# Altium project EBAZ4205扩展.PrjPcb
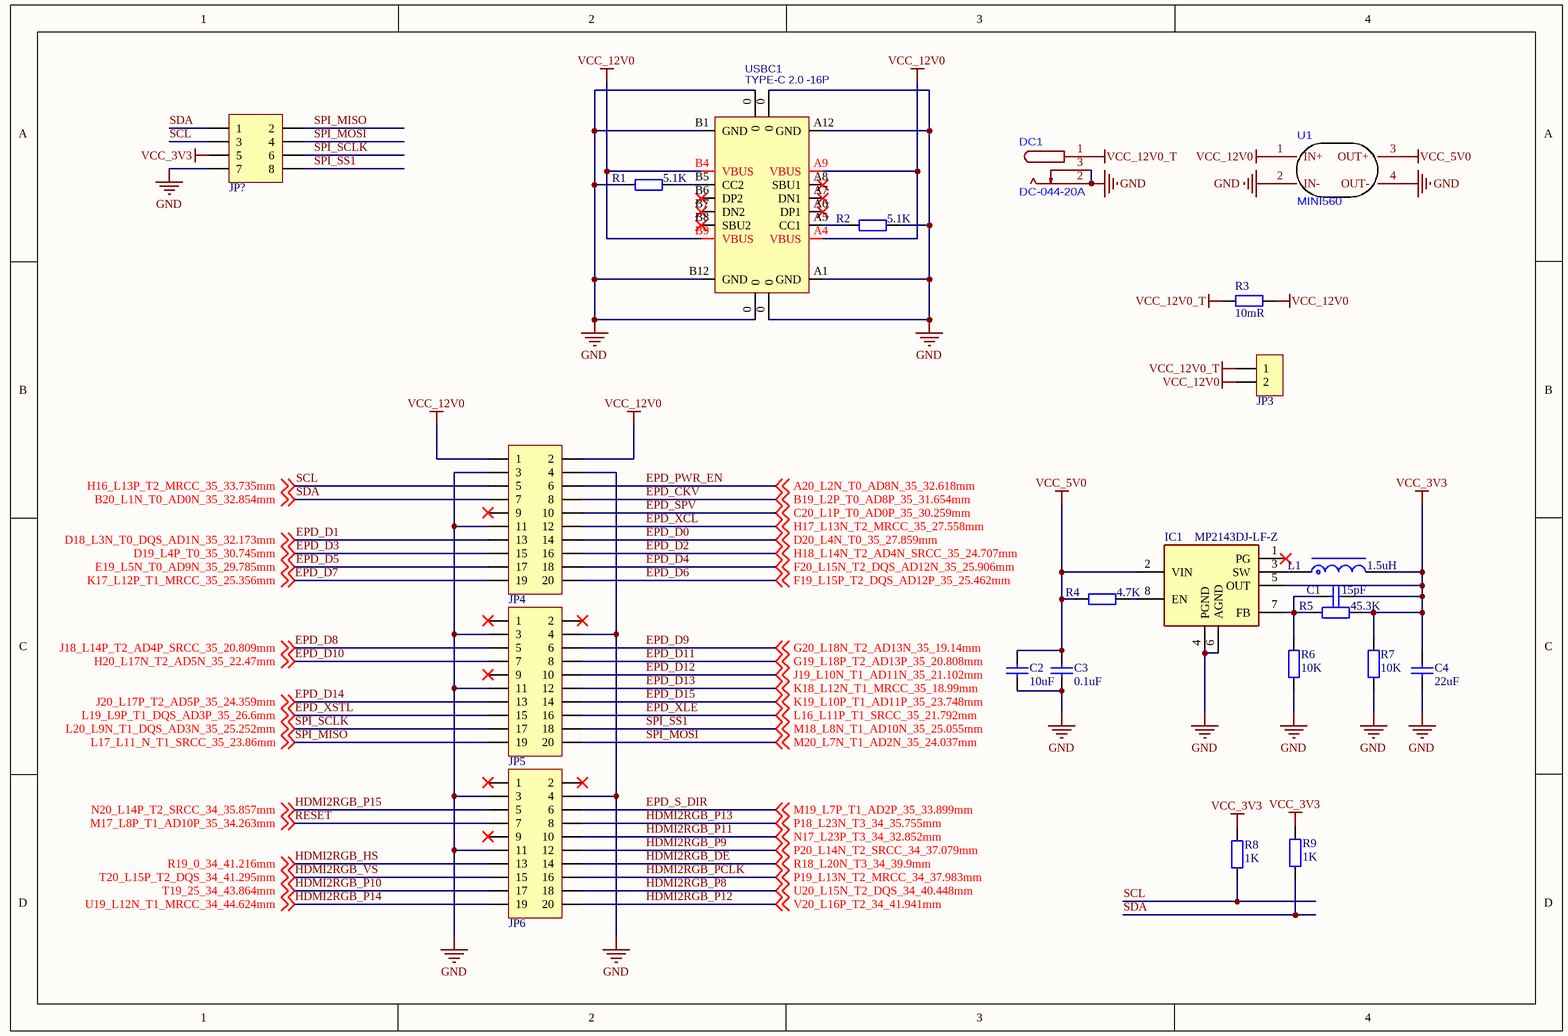
[diagram p0: EBAZ4205扩展_连接.SchDoc]
4 sheets, 110 parts. Net scope: global (net labels, ports and power ports of the same name join across sheets).
Board file: EBAZ4205扩展.PcbDoc
Sheets:
  EBAZ4205扩展_连接.SchDoc
  EBAZ4205扩展_RGB_RX.SchDoc
  EBAZ4205扩展_TPS65185.SchDoc
  EBAZ4205扩展_EPD_TX.SchDoc

## Sheet EBAZ4205扩展_连接.SchDoc
size A4; DocumentNumber: 4; SheetNumber: 1; SheetTotal: 4

### Parts
C1  15pF  [C0402_L]
C2  10uF  [C0805_L]
C3  0.1uF  [C0402_L]
C4  22uF  [C0805_L]
DC1  DC-044-20A  [DC-IN-TH_DC-044-20A]
IC1  MP2143DJ-LF-Z  [SOP65P280X100-8N]
JP3  HDR-1X2  [HDR1.27-LI-2P]  (value not drawn)
JP4  Header 2X10  [PHD2.0-LI-2x10P]  (value not drawn)
JP5  Header 2X10  [PHD2.0-LI-2x10P]  (value not drawn)
JP6  Header 2X10  [PHD2.0-LI-2x10P]  (value not drawn)
JP?  Header 4X2  [HDR2.54-LI-2x4P]  (value not drawn)
L1  1.5uH  [NR3010]
R1  5.1K  [R0402_L]
R2  5.1K  [R0402_L]
R3  10mR  [R0805-HP_L]
R4  4.7K  [R0402_L]
R5  45.3K  [R0402_L]
R6  10K  [R0402_L]
R7  10K  [R0402_L]
R8  1K  [R0402_L]
R9  1K  [R0402_L]
U1  MINI560  [MINI560]
USBC1  TYPE-C 2.0 -16P  [USB-C-SMD_16P]

### Nets
GND: C2.1 C3.1 C4.1 DC1.2 DC1.3 IC1.4(PGND) IC1.6(AGND) JP4.3 JP4.4 JP4.11 JP5.3 JP5.4 JP5.11 JP6.3 JP6.4 JP6.11 JP?.7 R1.2 R2.1 R6.1 R7.1 U1.2(IN-) U1.4(OUT-) USBC1.0 USBC1.A1(GND) USBC1.A12(GND) USBC1.B1(GND) USBC1.B12(GND)
VCC_3V3: C1.1 C4.2 IC1.5(OUT) JP?.5 L1.2 R5.1 R7.2 R8.2 R9.2
VCC_5V0: C2.2 C3.2 IC1.2(VIN) R4.2 U1.3(OUT+)
VCC_12V0: JP3.2 JP4.1 JP4.2 R3.2 U1.1(IN+) USBC1.A4(VBUS) USBC1.A9(VBUS) USBC1.B4(VBUS) USBC1.B9(VBUS)
VCC_12V0_T: DC1.1 JP3.1 R3.1
EPD_CKV: JP4.8 ; off-sheet B19_L2P_T0_AD8P_35_31.654mm  [also labelled B19_L2P_T0_AD8P_35_31.654mm]
EPD_D0: JP4.14 ; off-sheet D20_L4N_T0_35_27.859mm  [also labelled D20_L4N_T0_35_27.859mm]
EPD_D1: JP4.13 ; off-sheet D18_L3N_T0_DQS_AD1N_35_32.173mm  [also labelled D18_L3N_T0_DQS_AD1N_35_32.173mm]
EPD_D2: JP4.16 ; off-sheet H18_L14N_T2_AD4N_SRCC_35_24.707mm  [also labelled H18_L14N_T2_AD4N_SRCC_35_24.707mm]
EPD_D3: JP4.15 ; off-sheet D19_L4P_T0_35_30.745mm  [also labelled D19_L4P_T0_35_30.745mm]
EPD_D4: JP4.18 ; off-sheet F20_L15N_T2_DQS_AD12N_35_25.906mm  [also labelled F20_L15N_T2_DQS_AD12N_35_25.906mm]
EPD_D5: JP4.17 ; off-sheet E19_L5N_T0_AD9N_35_29.785mm  [also labelled E19_L5N_T0_AD9N_35_29.785mm]
EPD_D6: JP4.20 ; off-sheet F19_L15P_T2_DQS_AD12P_35_25.462mm  [also labelled F19_L15P_T2_DQS_AD12P_35_25.462mm]
EPD_D7: JP4.19 ; off-sheet K17_L12P_T1_MRCC_35_25.356mm  [also labelled K17_L12P_T1_MRCC_35_25.356mm]
EPD_D8: JP5.5 ; off-sheet J18_L14P_T2_AD4P_SRCC_35_20.809mm  [also labelled J18_L14P_T2_AD4P_SRCC_35_20.809mm]
EPD_D9: JP5.6 ; off-sheet G20_L18N_T2_AD13N_35_19.14mm  [also labelled G20_L18N_T2_AD13N_35_19.14mm]
EPD_D10: JP5.7 ; off-sheet H20_L17N_T2_AD5N_35_22.47mm  [also labelled H20_L17N_T2_AD5N_35_22.47mm]
EPD_D11: JP5.8 ; off-sheet G19_L18P_T2_AD13P_35_20.808mm  [also labelled G19_L18P_T2_AD13P_35_20.808mm]
EPD_D12: JP5.10 ; off-sheet J19_L10N_T1_AD11N_35_21.102mm  [also labelled J19_L10N_T1_AD11N_35_21.102mm]
EPD_D13: JP5.12 ; off-sheet K18_L12N_T1_MRCC_35_18.99mm  [also labelled K18_L12N_T1_MRCC_35_18.99mm]
EPD_D14: JP5.13 ; off-sheet J20_L17P_T2_AD5P_35_24.359mm  [also labelled J20_L17P_T2_AD5P_35_24.359mm]
EPD_D15: JP5.14 ; off-sheet K19_L10P_T1_AD11P_35_23.748mm  [also labelled K19_L10P_T1_AD11P_35_23.748mm]
EPD_PWR_EN: JP4.6 ; off-sheet A20_L2N_T0_AD8N_35_32.618mm  [also labelled A20_L2N_T0_AD8N_35_32.618mm]
EPD_S_DIR: JP6.6 ; off-sheet M19_L7P_T1_AD2P_35_33.899mm  [also labelled M19_L7P_T1_AD2P_35_33.899mm]
EPD_SPV: JP4.10 ; off-sheet C20_L1P_T0_AD0P_35_30.259mm  [also labelled C20_L1P_T0_AD0P_35_30.259mm]
EPD_XCL: JP4.12 ; off-sheet H17_L13N_T2_MRCC_35_27.558mm  [also labelled H17_L13N_T2_MRCC_35_27.558mm]
EPD_XLE: JP5.16 ; off-sheet L16_L11P_T1_SRCC_35_21.792mm  [also labelled L16_L11P_T1_SRCC_35_21.792mm]
EPD_XSTL: JP5.15 ; off-sheet L19_L9P_T1_DQS_AD3P_35_26.6mm  [also labelled L19_L9P_T1_DQS_AD3P_35_26.6mm]
HDMI2RGB_DE: JP6.14 ; off-sheet R18_L20N_T3_34_39.9mm  [also labelled R18_L20N_T3_34_39.9mm]
HDMI2RGB_HS: JP6.13 ; off-sheet R19_0_34_41.216mm  [also labelled R19_0_34_41.216mm]
HDMI2RGB_P8: JP6.18 ; off-sheet U20_L15N_T2_DQS_34_40.448mm  [also labelled U20_L15N_T2_DQS_34_40.448mm]
HDMI2RGB_P9: JP6.12 ; off-sheet P20_L14N_T2_SRCC_34_37.079mm  [also labelled P20_L14N_T2_SRCC_34_37.079mm]
HDMI2RGB_P10: JP6.17 ; off-sheet T19_25_34_43.864mm  [also labelled T19_25_34_43.864mm]
HDMI2RGB_P11: JP6.10 ; off-sheet N17_L23P_T3_34_32.852mm  [also labelled N17_L23P_T3_34_32.852mm]
HDMI2RGB_P12: JP6.20 ; off-sheet V20_L16P_T2_34_41.941mm  [also labelled V20_L16P_T2_34_41.941mm]
HDMI2RGB_P13: JP6.8 ; off-sheet P18_L23N_T3_34_35.755mm  [also labelled P18_L23N_T3_34_35.755mm]
HDMI2RGB_P14: JP6.19 ; off-sheet U19_L12N_T1_MRCC_34_44.624mm  [also labelled U19_L12N_T1_MRCC_34_44.624mm]
HDMI2RGB_P15: JP6.5 ; off-sheet N20_L14P_T2_SRCC_34_35.857mm  [also labelled N20_L14P_T2_SRCC_34_35.857mm]
HDMI2RGB_PCLK: JP6.16 ; off-sheet P19_L13N_T2_MRCC_34_37.983mm  [also labelled P19_L13N_T2_MRCC_34_37.983mm]
HDMI2RGB_VS: JP6.15 ; off-sheet T20_L15P_T2_DQS_34_41.295mm  [also labelled T20_L15P_T2_DQS_34_41.295mm]
RESET: JP6.7 ; off-sheet M17_L8P_T1_AD10P_35_34.263mm  [also labelled M17_L8P_T1_AD10P_35_34.263mm]
SCL: JP4.5 JP?.3 R8.1 ; off-sheet H16_L13P_T2_MRCC_35_33.735mm  [also labelled H16_L13P_T2_MRCC_35_33.735mm]
SDA: JP4.7 JP?.1 R9.1 ; off-sheet B20_L1N_T0_AD0N_35_32.854mm  [also labelled B20_L1N_T0_AD0N_35_32.854mm]
SPI_MISO: JP5.19 JP?.2 ; off-sheet L17_L11_N_T1_SRCC_35_23.86mm  [also labelled L17_L11_N_T1_SRCC_35_23.86mm]
SPI_MOSI: JP5.20 JP?.4 ; off-sheet M20_L7N_T1_AD2N_35_24.037mm  [also labelled M20_L7N_T1_AD2N_35_24.037mm]
SPI_SCLK: JP5.17 JP?.6 ; off-sheet L20_L9N_T1_DQS_AD3N_35_25.252mm  [also labelled L20_L9N_T1_DQS_AD3N_35_25.252mm]
SPI_SS1: JP5.18 JP?.8 ; off-sheet M18_L8N_T1_AD10N_35_25.055mm  [also labelled M18_L8N_T1_AD10N_35_25.055mm]
NetC1_2: C1.2 IC1.7(FB) R5.2 R6.2
NetIC1_3: IC1.3(SW) L1.1
NetIC1_8: IC1.8(EN) R4.1
NetR1_1: R1.1 USBC1.B5(CC2)
NetR2_2: R2.2 USBC1.A5(CC1)

Not connected (* = marked no-connect by the designer): IC1 1(PG)*; JP4 9*; JP5 1* 2* 9*; JP6 1* 2* 9*; USBC1 A6(DP1)* A7(DN1)* A8(SBU1)* B6(DP2)* B7(DN2)* B8(SBU2)*

### Library data of the parts
C1-C4 = C: 贴片电容; BOM名称: 无极性贴片电容; 联系卖家，免费查找封装: 唯一出售店铺网址https://shop463601444.taobao.com
IC1 = MP2143DJ-LF-Z: Integrated Circuit; Manufacturer_Name: Monolithic Power Systems (MPS); Datasheet Link: https://www.mouser.com/ds/2/277/MP2143_r1.07-371732.pdf; Height: 1mm; Manufacturer_Part_Number: MP2143DJ-LF-Z; Mouser Part Number: 946-MP2143DJLFZ; Mouser Price/Stock: https://www.mouser.co.uk/ProductDetail/Monolithic-Power-Systems-MPS/MP2143DJ-LF-Z?qs=QEkzKklKf2Sh6e0cSbvEyA%3D%3D
JP3 = Header 2: 2P接插件; 版权归属: 源创客; BOM名称: 2P接插件; 学习资源: www.ooocke.com
JP4-JP6 = Header 10X2: 10*2P接插件; 封装库来自淘宝卖家 ID：黄晶宝石: 其他店铺购入均为盗版，不享受售后技术支持服务，请立即申请退款
JP? = Header 4X2: 4*2P接插件; 封装库来自淘宝卖家 ID：黄晶宝石: 其他店铺购入均为盗版假冒封装库; 联系卖家，免费查找封装: 唯一出售店铺网址https://shop463601444.taobao.com; BOM名称: 4*2P接插件
L1 = L-NR: 太诱-NR磁胶电感; 0.0_BOM名称: NR磁胶电感; 3.交流分享: Q群514746572,开源更新,欢迎一起交流学习PCB设计; 4.作者声明: 旨为整合最全库集,欢迎转载,禁止商用！-冰凌猫; 5.备注说明: 该库已二次整合过网上各热销库,基本最全,无需重复搜购安装; 1.库作者: 冰凌猫; 2.库版本: v2.0 (2021.03.30)
R1 R2 R4-R9 = R: 贴片电阻; 联系卖家，免费查找封装: 唯一出售店铺网址https://shop463601444.taobao.com; 封装库来自淘宝卖家ID：黄晶宝石: 其他店铺购入均为盗版假冒封装库，请立即申请退款; BOM名称: 贴片电阻
R3 = R-High Precision: 贴片精密电阻; BOM名称: 精密电阻; 联系卖家，免费查找封装: 唯一出售店铺网址https://shop463601444.taobao.com; 封装库来自淘宝卖家ID：黄晶宝石: 其他店铺购入均为盗版假冒封装库，请立即申请退款
USBC1 = USB2.0_Type-C_16Pin: USB2.0 Type-C 16Pin  母座; 联系卖家，免费技术支持: 唯一出售店铺网址https://shop463601444.taobao.com

## Sheet EBAZ4205扩展_RGB_RX.SchDoc
size A4; DocumentNumber: 3; SheetNumber: 2; SheetTotal: 4
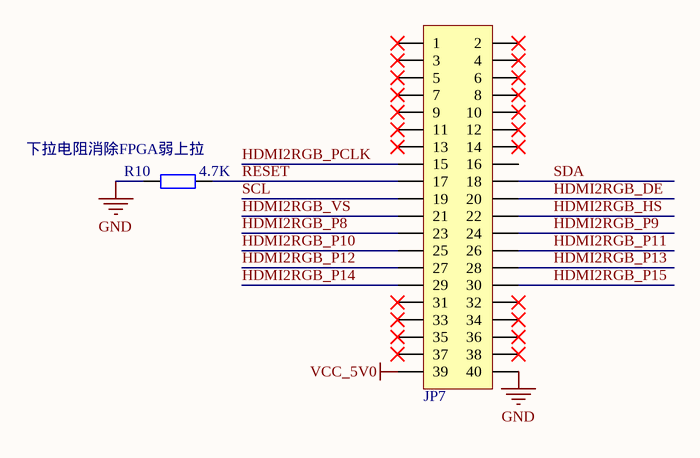
[diagram p1: EBAZ4205扩展_RGB_RX.SchDoc]

### Parts
JP7  Header 2X11  [PHD2.0-LI-2x20P]  (value not drawn)
R10  4.7K  [R0402_L]

### Nets
GND: JP7.40 R10.1
VCC_5V0: JP7.39
HDMI2RGB_DE: JP7.20
HDMI2RGB_HS: JP7.22
HDMI2RGB_P8: JP7.23
HDMI2RGB_P9: JP7.24
HDMI2RGB_P10: JP7.25
HDMI2RGB_P11: JP7.26
HDMI2RGB_P12: JP7.27
HDMI2RGB_P13: JP7.28
HDMI2RGB_P14: JP7.29
HDMI2RGB_P15: JP7.30
HDMI2RGB_PCLK: JP7.15
HDMI2RGB_VS: JP7.21
RESET: JP7.17 R10.2
SCL: JP7.19
SDA: JP7.18

Not connected (* = marked no-connect by the designer): JP7 1* 2* 3* 4* 5* 6* 7* 8* 9* 10* 11* 12* 13* 14* 16 31* 32* 33* 34* 35* 36* 37* 38*

### Notes on the sheet
- (near R10) 下拉电阻消除FPGA弱上拉

### Library data of the parts
JP7 = Header 20X2: 20*2P接插件; 封装库来自淘宝卖家 ID：黄晶宝石: 其他店铺购入均为盗版假冒封装库; BOM名称: 20*2P接插件
R10 = R: 贴片电阻; 3.交流分享: Q群514746572,开源更新,欢迎一起交流学习PCB设计; 4.作者声明: 旨为整合最全库集,欢迎转载,禁止商用！-冰凌猫; 5.备注说明: 该库已二次整合过网上各热销库,基本最全,无需重复搜购安装; 1.库作者: 冰凌猫; 2.库版本: v2.0 (2021.03.30); 0.0_BOM名称: 贴片电阻

## Sheet EBAZ4205扩展_TPS65185.SchDoc
size A4; DocumentNumber: 4; SheetNumber: 3; SheetTotal: 4
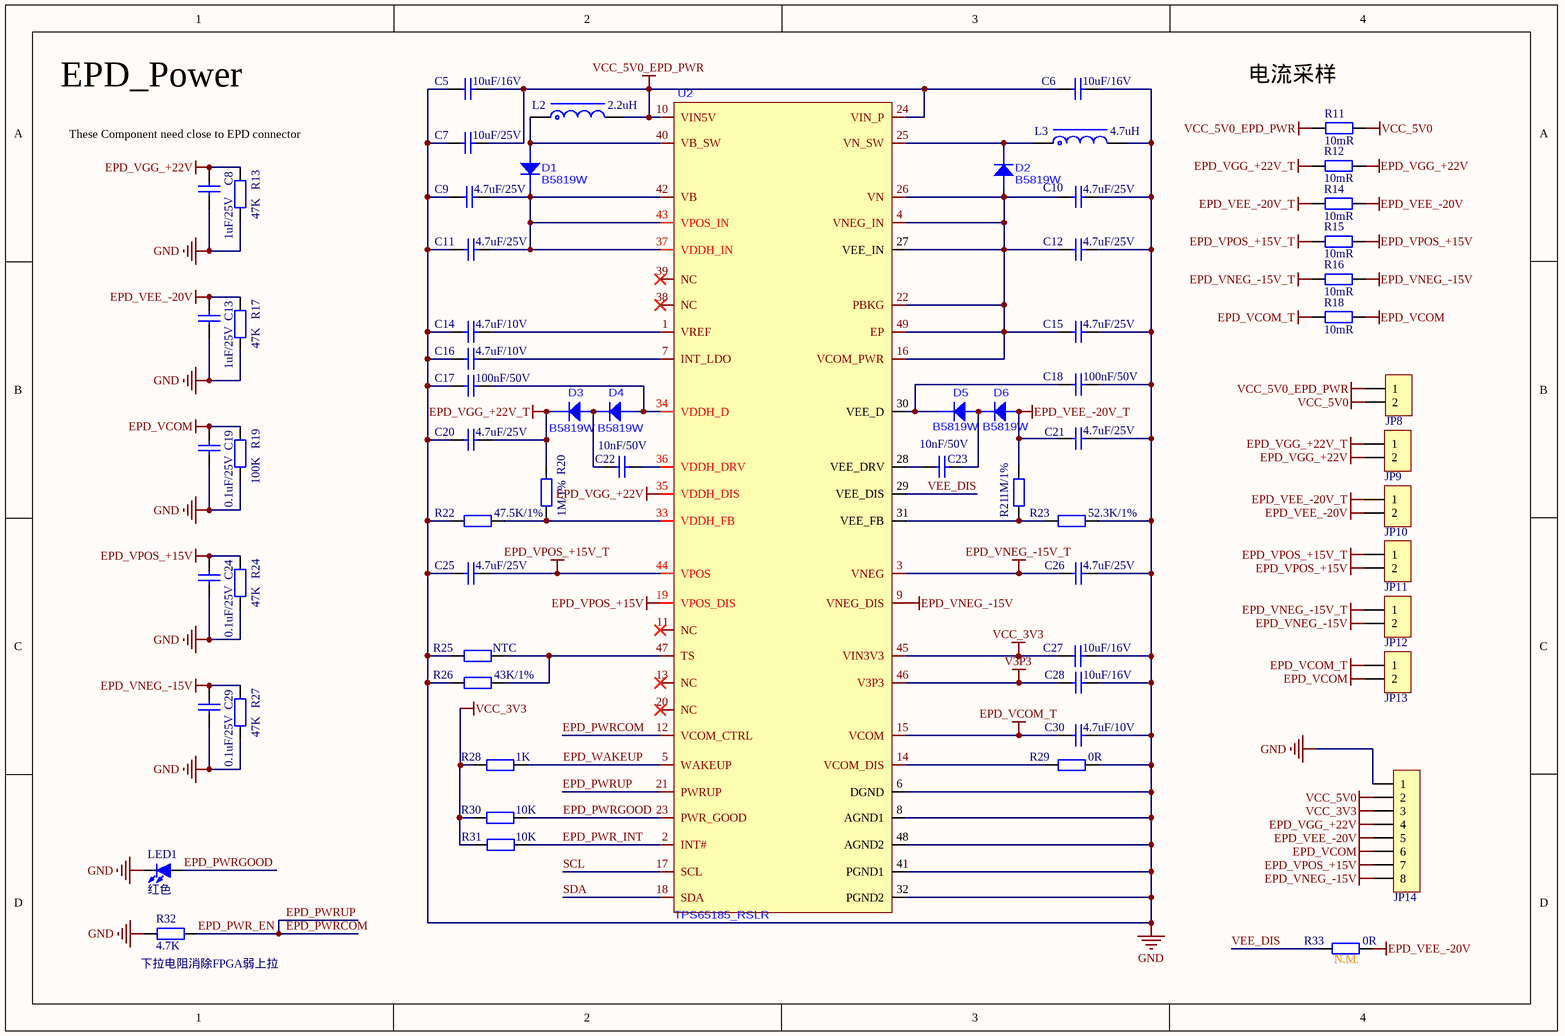
[diagram p2: EBAZ4205扩展_TPS65185.SchDoc]

### Parts
C5  10uF/16V  [C0603_L]
C6  10uF/16V  [C0603_L]
C7  10uF/25V  [C0805_L]
C8  1uF/25V  [C0402_L]
C9  4.7uF/25V  [C1206_L]
C10  4.7uF/25V  [C1206_L]
C11  4.7uF/25V  [C1206_L]
C12  4.7uF/25V  [C1206_L]
C13  1uF/25V  [C0402_L]
C14  4.7uF/10V  [C0603_L]
C15  4.7uF/25V  [C1206_L]
C16  4.7uF/10V  [C0603_L]
C17  100nF/50V  [C0603_L]
C18  100nF/50V  [C0603_L]
C19  0.1uF/25V  [C0402_L]
C20  4.7uF/25V  [C1206_L]
C21  4.7uF/25V  [C1206_L]
C22  10nF/50V  [C0603_L]
C23  10nF/50V  [C0603_L]
C24  0.1uF/25V  [C0402_L]
C25  4.7uF/25V  [C1206_L]
C26  4.7uF/25V  [C1206_L]
C27  10uF/16V  [C0402_L]
C28  10uF/16V  [C0402_L]
C29  0.1uF/25V  [C0402_L]
C30  4.7uF/10V  [C0603_L]
D1  B5819W  [SOD-123]
D2  B5819W  [SOD-123]
D3  B5819W  [SOD-123]
D4  B5819W  [SOD-123]
D5  B5819W  [SOD-123]
D6  B5819W  [SOD-123]
JP8  HDR-1X2  [HDR1.27-LI-2P]  (value not drawn)
JP9  HDR-1X2  [HDR1.27-LI-2P]  (value not drawn)
JP10  HDR-1X2  [HDR1.27-LI-2P]  (value not drawn)
JP11  HDR-1X2  [HDR1.27-LI-2P]  (value not drawn)
JP12  HDR-1X2  [HDR1.27-LI-2P]  (value not drawn)
JP13  HDR-1X2  [HDR1.27-LI-2P]  (value not drawn)
JP14  HDR-1X8  [HDR2.54-LI-8P]  (value not drawn)
L2  2.2uH  [NR6020]
L3  4.7uH  [NR6020]
LED1  红色  [LED0603_B]
R11  10mR  [R0805-HP_L]
R12  10mR  [R0805-HP_L]
R13  47K  [R0402_L]
R14  10mR  [R0805-HP_L]
R15  10mR  [R0805-HP_L]
R16  10mR  [R0805-HP_L]
R17  47K  [R0402_L]
R18  10mR  [R0805-HP_L]
R19  100K  [R0402_L]
R20  1M/1%  [R0402_L]
R21  1M/1%  [R0402_L]
R22  47.5K/1%  [R0402_L]
R23  52.3K/1%  [R0402_L]
R24  47K  [R0402_L]
R25  NTC  [R0402_L]
R26  43K/1%  [R0402_L]
R27  47K  [R0402_L]
R28  1K  [R0402_L]
R29  0R  [R0402_L]
R30  10K  [R0402_L]
R31  10K  [R0402_L]
R32  4.7K  [R0402_L]
R33  0R  [R0402_L]
U2  TPS65185_RSLR  [TPS65185_RSLR]

### Nets
EPD_VCOM: C19.2 JP13.2 JP14.6 R18.2 R19.1
EPD_VCOM_T: C30.1 JP13.1 R18.1 U2.15(VCOM)
EPD_VEE_-20V: C13.2 JP10.2 JP14.5 R14.2 R17.1 R33.2
EPD_VEE_-20V_T: C21.1 D6.1(A) JP10.1 R14.1 R21.1
EPD_VGG_+22V: C8.2 JP9.2 JP14.4 R12.2 R13.1 U2.35(VDDH_DIS)
EPD_VGG_+22V_T: C20.2 D3.2(K) JP9.1 R12.1 R20.1
EPD_VNEG_-15V: C29.2 JP12.2 JP14.8 R16.2 R27.1 U2.9(VNEG_DIS)
EPD_VNEG_-15V_T: C26.1 JP12.1 R16.1 U2.3(VNEG)
EPD_VPOS_+15V: C24.2 JP11.2 JP14.7 R15.2 R24.1 U2.19(VPOS_DIS)
EPD_VPOS_+15V_T: C25.2 JP11.1 R15.1 U2.44(VPOS)
GND: C5.1 C6.2 C7.1 C8.1 C9.1 C10.2 C11.1 C12.2 C13.1 C14.1 C15.2 C16.1 C17.1 C18.2 C19.1 C20.1 C21.2 C24.1 C25.1 C26.2 C27.2 C28.2 C29.1 C30.2 JP14.1 L3.2 LED1.2(K) R13.2 R17.2 R19.2 R22.2 R23.2 R24.2 R25.2 R26.2 R27.2 R29.2 R32.2 U2.6(DGND) U2.8(AGND1) U2.32(PGND2) U2.41(PGND1) U2.48(AGND2)
V3P3: C28.1 U2.46(V3P3)
VCC_3V3: C27.1 JP14.3 R28.2 R30.2 R31.2 U2.45(VIN3V3)
VCC_5V0: JP8.2 JP14.2 R11.2
VCC_5V0_EPD_PWR: C5.2 C6.1 C7.2 JP8.1 L2.2 R11.1 U2.10(VIN5V) U2.24(VIN_P)
EPD_PWR_EN: R32.1 U2.12(VCOM_CTRL) U2.21(PWRUP)  [also labelled EPD_PWRCOM, EPD_PWRUP]
EPD_PWR_INT: R31.1 U2.2(INT#)
EPD_PWRGOOD: LED1.1(A) R30.1 U2.23(PWR_GOOD)
EPD_WAKEUP: R28.1 U2.5(WAKEUP)
SCL: U2.17(SCL)
SDA: U2.18(SDA)
VEE_DIS: R33.1 U2.29(VEE_DIS)
NetC9_2: C9.2 C11.2 D1.2(K) U2.37(VDDH_IN) U2.42(VB) U2.43(VPOS_IN)
NetC10_1: C10.1 C12.1 C15.1 D2.1(A) U2.4(VNEG_IN) U2.16(VCOM_PWR) U2.22(PBKG) U2.26(VN) U2.27(VEE_IN) U2.49(EP)
NetC14_2: C14.2 U2.1(VREF)
NetC16_2: C16.2 U2.7(INT_LDO)
NetC17_2: C17.2 D4.1(A) U2.34(VDDH_D)
NetC18_1: C18.1 D5.2(K) U2.30(VEE_D)
NetC22_1: C22.1 D3.1(A) D4.2(K)
NetC22_2: C22.2 U2.36(VDDH_DRV)
NetC23_1: C23.1 U2.28(VEE_DRV)
NetC23_2: C23.2 D5.1(A) D6.2(K)
NetD1_1: D1.1(A) L2.1 U2.40(VB_SW)
NetD2_2: D2.2(K) L3.1 U2.25(VN_SW)
NetR20_2: R20.2 R22.1 U2.33(VDDH_FB)
NetR21_2: R21.2 R23.1 U2.31(VEE_FB)
NetR25_1: R25.1 R26.1 U2.47(TS)
NetR29_1: R29.1 U2.14(VCOM_DIS)

Not connected (* = marked no-connect by the designer): U2 11(NC)* 13(NC)* 20(NC)* 38(NC)* 39(NC)*

### Notes on the sheet
- EPD_Power
- (near R11) 电流采样
- These Component need close to EPD connector
- (near R32) 下拉电阻消除FPGA弱上拉
- (near R33) N.M.

### Library data of the parts
C5-C30 = C: 贴片电容; 0.0_BOM名称: 无极性贴片电容; 3.交流分享: Q群514746572,开源更新,欢迎一起交流学习PCB设计; 4.作者声明: 旨为整合最全库集,欢迎转载,禁止商用！-冰凌猫; 5.备注说明: 该库已二次整合过网上各热销库,基本最全,无需重复搜购安装; 1.库作者: 冰凌猫; 2.库版本: v2.0 (2021.03.30)
JP8-JP13 = Header 2: 2P接插件; 版权归属: 源创客; BOM名称: 2P接插件; 学习资源: www.ooocke.com
JP14 = Header 8: 8P接插件; 版权归属: 源创客; BOM名称: 8P接插件; 学习资源: www.ooocke.com
L2 L3 = L-NR: as L1 on sheet EBAZ4205扩展_连接
LED1 = LED-SMD: 贴片LED; 封装库来自淘宝卖家 ID：黄晶宝石: 其他店铺购入均为假冒，请立即申请退款，本店奖励现金5~20元; BOM名称: 贴片LED
R11 R12 R14-R16 R18 = R-High Precision: as R3 on sheet EBAZ4205扩展_连接
R13 R17 R19-R33 = R: as R10 on sheet EBAZ4205扩展_RGB_RX; 0.0_BOM名称: 贴片电阻

## Sheet EBAZ4205扩展_EPD_TX.SchDoc
size A4; DocumentNumber: 5; SheetNumber: 4; SheetTotal: 4
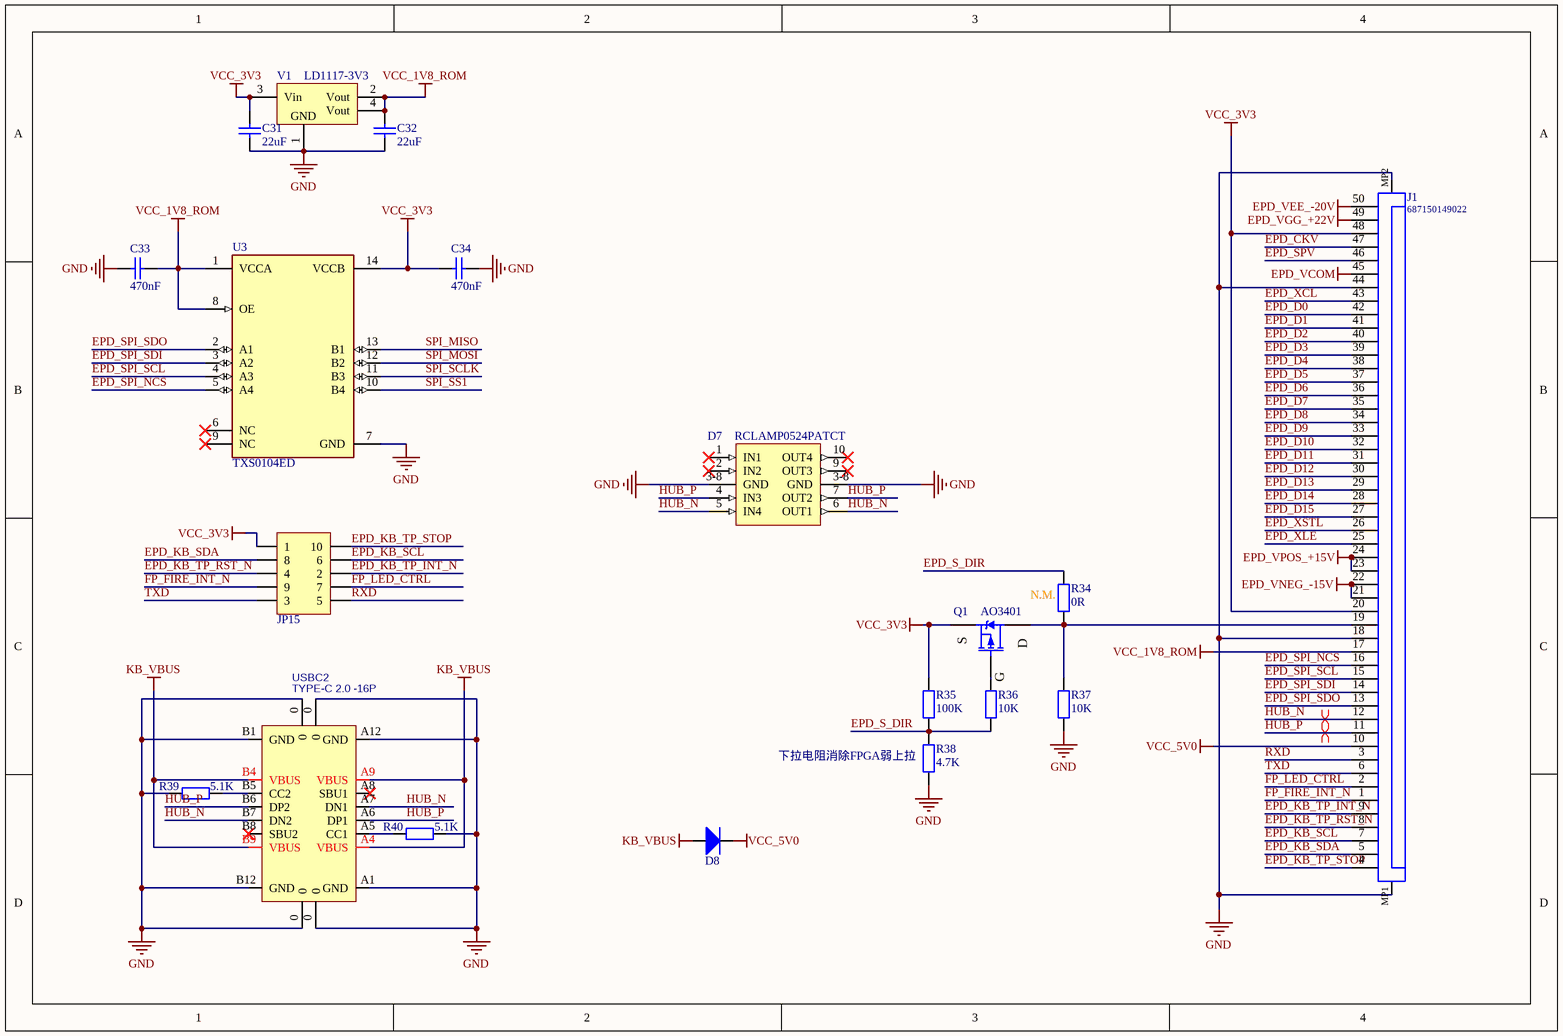
[diagram p3: EBAZ4205扩展_EPD_TX.SchDoc]

### Parts
C31  22uF  [C0603_L]
C32  22uF  [C0603_L]
C33  470nF  [C0603_L]
C34  470nF  [C0603_L]
D7  RCLAMP0524PATCT  [FP-SLP2510P8-MFG]
D8  TVS  [SOD-123]  (value not drawn)
J1  687150149022  [687150149022]
JP15  Header 5X2  [HDR2.54-LI-2x5P]  (value not drawn)
Q1  AO3401  [SOT23-3N]
R34  0R  [R0402_L]
R35  100K  [R0402_L]
R36  10K  [R0402_L]
R37  10K  [R0402_L]
R38  4.7K  [R0402_L]
R39  5.1K  [R0402_L]
R40  5.1K  [R0402_L]
U3  TXS0104ED  [FP-D0014A-IPC_C]
USBC2  TYPE-C 2.0 -16P  [USB-C-SMD_16P]
V1  LD1117-3V3  [SOT223_L]

### Nets
EPD_VCOM: J1.45
EPD_VEE_-20V: J1.50
EPD_VGG_+22V: J1.49
EPD_VNEG_-15V: J1.21 J1.22
EPD_VPOS_+15V: J1.23 J1.24
GND: C31.1 C32.1 C33.1 C34.2 D7.3-8(GND) J1.18 J1.44 J1.MP1 J1.MP2 R37.2 R38.1 R39.2 R40.1 U3.7(GND) USBC2.0 USBC2.A1(GND) USBC2.A12(GND) USBC2.B1(GND) USBC2.B12(GND) V1.1(GND)
KB_VBUS: D8.1(A) USBC2.A4(VBUS) USBC2.A9(VBUS) USBC2.B4(VBUS) USBC2.B9(VBUS)
VCC_1V8_ROM: C32.2 C33.2 J1.17 U3.1(VCCA) U3.8(OE) V1.2(Vout) V1.4(Vout)
VCC_3V3: C31.2 C34.1 J1.20 J1.48 JP15.1 Q1.2(S) R35.1 U3.14(VCCB) V1.3(Vin)
VCC_5V0: D8.2(K) J1.10
EPD_CKV: J1.47
EPD_D0: J1.42
EPD_D1: J1.41
EPD_D2: J1.40
EPD_D3: J1.39
EPD_D4: J1.38
EPD_D5: J1.37
EPD_D6: J1.36
EPD_D7: J1.35
EPD_D8: J1.34
EPD_D9: J1.33
EPD_D10: J1.32
EPD_D11: J1.31
EPD_D12: J1.30
EPD_D13: J1.29
EPD_D14: J1.28
EPD_D15: J1.27
EPD_KB_SCL: J1.7 JP15.6
EPD_KB_SDA: J1.5 JP15.8
EPD_KB_TP_INT_N: J1.9 JP15.2
EPD_KB_TP_RST_N: J1.8 JP15.4
EPD_KB_TP_STOP: J1.4 JP15.10
EPD_S_DIR: R34.1 R35.2 R36.2 R38.2
EPD_SPI_NCS: J1.16 U3.5(A4)
EPD_SPI_SCL: J1.15 U3.4(A3)
EPD_SPI_SDI: J1.14 U3.3(A2)
EPD_SPI_SDO: J1.13 U3.2(A1)
EPD_SPV: J1.46
EPD_XCL: J1.43
EPD_XLE: J1.25
EPD_XSTL: J1.26
FP_FIRE_INT_N: J1.1 JP15.9
FP_LED_CTRL: J1.2 JP15.7
HUB_N: D7.5(IN4) D7.6(OUT1) J1.12 USBC2.A7(DN1) USBC2.B7(DN2)
HUB_P: D7.4(IN3) D7.7(OUT2) J1.11 USBC2.A6(DP1) USBC2.B6(DP2)
RXD: J1.3 JP15.5
SPI_MISO: U3.13(B1)
SPI_MOSI: U3.12(B2)
SPI_SCLK: U3.11(B3)
SPI_SS1: U3.10(B4)
TXD: J1.6 JP15.3
NetJ1_19: J1.19 Q1.3(D) R34.2 R37.1
NetQ1_1: Q1.1(G) R36.1
NetR39_1: R39.1 USBC2.B5(CC2)
NetR40_2: R40.2 USBC2.A5(CC1)

Not connected (* = marked no-connect by the designer): D7 1(IN1)* 2(IN2)* 9(OUT3)* 10(OUT4)*; U3 6(NC)* 9(NC)*; USBC2 A8(SBU1)* B8(SBU2)*

### Layout directives
differential pair: HUB_N, HUB_P

### Notes on the sheet
- (near R34) N.M.
- 下拉电阻消除FPGA弱上拉

### Library data of the parts
C31-C34 = C: as C1 on sheet EBAZ4205扩展_连接
D7 = RCLAMP0524PATCT: TVS DIODE 5V 15V SLP2510P8; Number of Unidirectional Channels: 4; Min Breakdown Voltage: 6V; Direction: Unidirectional; Power Line Protection: Yes; Peak Pulse Power: 150W; Leakage Current: 1uA; Capacitance: 0.8pF; Peak Pulse Current: 1A; Series: RailClamp®; Min Operating Temperature: -55°C; Number of Bidirectional Channels: 4; Mount: Surface Mount; Clamping Voltage: 15V; Clamping Voltage-Max: 15V; Max Operating Temperature: 125°C; Working Voltage: 5V; Case/Package: SMD/SMT; Packaging: Tape and Reel; RoHS Compliant: Yes; Reverse Standoff Voltage: 5V; Radiation Hardening: No; Number of Pins: 10; Depth: 1mm; Length: 2.5mm
D8 = TVS: TVS通用; 联系卖家，免费查找封装: 唯一出售店铺网址https://shop463601444.taobao.com; Code_JEDEC: DO-214-AB
J1 = CMP-1502-01644-1: SMT ZIF Connectors Hinge Type WR-FPC, Horizontal, Bottom Contact, pitch 0.5 mm, 50 pins; Manufacturer: Wurth Elektronik; Pin Number: 50; Contact Resistance: 50mOhm; Working Voltage: 50VAC; Withstanding Voltage: 150VAC; Rated Current: 0.5A; Pitch: 0.5mm; Contact Design: BottomContact; Datasheet URL: https://katalog.we-online.de/em/datasheet/687150149022.pdf; Part Number: 687150149022; Packaging: TapeandReel; Mounting Technology: SMT; Operating Temperature: -40to105degC; Orientation: Horizontal; Publisher: WurthElektronik; Manufacturer URL: http://www.we-online.de; Package Reference: 687150149022
JP15 = Header 5X2: 5*2P接插件; 封装库来自淘宝卖家 ID：黄晶宝石: 其他店铺购入均为盗版假冒封装库; 联系卖家，免费查找封装: 唯一出售店铺网址https://shop463601444.taobao.com; BOM名称: 5*2P接插件
Q1 = AO3401: P沟道 30V/4.2A; BOM名称: 场效应管; 封装库来自淘宝卖家 ID：黄晶宝石: 其他店铺购入均为盗版，不享受售后技术支持服务，请立即申请退款; 联系卖家，免费查找封装: 唯一出售店铺网址https://shop463601444.taobao.com; 参数: P沟道 30V/4.2A
R34-R37 R39 R40 = R: as R1 on sheet EBAZ4205扩展_连接; BOM名称: 贴片电阻
R38 = R: as R10 on sheet EBAZ4205扩展_RGB_RX; 0.0_BOM名称: 贴片电阻
U3 = CMP-04899-000005-1: IC TRNSLTR BIDIRECTIONAL 14SOIC; Manufacturer: Texas Instruments; Min Supply Voltage: 1.65V; V A Min: 1.25V; Standoff Height: 0.1mm; Max Junction Temp: +150°C; Nominal Supply Current: 14.4uA; Data Rate: 24Mbits/s; Number Of Outputs: 4; V B Max: 4.4V; V B Min: 0.4V; Propagation Delay: 165ns; Number Of Circuits: 1; Max Supply Voltage: 5.5V; V A Max: 3.6V; Logic Function Desc: Non-Inverting; Ambient Temperature Range High: +85°C; Category: IC; Device Class L1: Integrated Circuits (ICs); Ambient Temperature Range Low: -40°C; Height: 1.75mm; Digikey Description: IC TRNSLTR BIDIRECTIONAL 14SOIC; Device Class L2: Logic ICs; Automotive: No; Mouser Description: 4-Bit Bidirectional Voltage-Level Shifter for Open-Drain and Push-Pull Applications 14-SOIC -40 to 85; Lead Free: Yes; Temperature Range High: +85°C; ComponentLink2URL: http://www.ti.com/lit/ds/symlink/txs0104e.pdf; ComponentLink2Description: Datasheet; Manufacturer Part Number: TXS0104ED; Device Class L3: Voltage Level Shifters; RoHS: TRUE; Temperature: -40°C to +85°C; Package: D0014A; Number Of Inputs: 4; Temperature Range Low: -40°C; Octopart: https://octopart.com/txs0104ed-texas+instruments-1486620
USBC2 = USB2.0_Type-C_16Pin: as USBC1 on sheet EBAZ4205扩展_连接
V1 = LD1117: 三端稳压芯片; BOM名称: 稳压芯片; 封装库来自淘宝卖家 ID：黄晶宝石: 其他店铺购入均为盗版，请立即申请退款，本店现金奖励5~20元; 联系卖家 免费查找封装: 唯一出售店铺网址https://shop463601444.taobao.com

## Nets that join several sheets
EPD_VCOM: EBAZ4205扩展_TPS65185 (5 pins), EBAZ4205扩展_EPD_TX (J1.45)
EPD_VEE_-20V: EBAZ4205扩展_TPS65185 (6 pins), EBAZ4205扩展_EPD_TX (J1.50)
EPD_VGG_+22V: EBAZ4205扩展_TPS65185 (6 pins), EBAZ4205扩展_EPD_TX (J1.49)
EPD_VNEG_-15V: EBAZ4205扩展_TPS65185 (6 pins), EBAZ4205扩展_EPD_TX (J1.21 J1.22)
EPD_VPOS_+15V: EBAZ4205扩展_TPS65185 (6 pins), EBAZ4205扩展_EPD_TX (J1.23 J1.24)
GND: EBAZ4205扩展_连接 (28 pins), EBAZ4205扩展_RGB_RX (JP7.40 R10.1), EBAZ4205扩展_TPS65185 (43 pins), EBAZ4205扩展_EPD_TX (20 pins)
VCC_3V3: EBAZ4205扩展_连接 (9 pins), EBAZ4205扩展_TPS65185 (6 pins), EBAZ4205扩展_EPD_TX (9 pins)
VCC_5V0: EBAZ4205扩展_连接 (5 pins), EBAZ4205扩展_RGB_RX (JP7.39), EBAZ4205扩展_TPS65185 (JP8.2 JP14.2 R11.2), EBAZ4205扩展_EPD_TX (D8.2 J1.10)
EPD_CKV: EBAZ4205扩展_连接 (JP4.8), EBAZ4205扩展_EPD_TX (J1.47)
EPD_D0: EBAZ4205扩展_连接 (JP4.14), EBAZ4205扩展_EPD_TX (J1.42)
EPD_D1: EBAZ4205扩展_连接 (JP4.13), EBAZ4205扩展_EPD_TX (J1.41)
EPD_D2: EBAZ4205扩展_连接 (JP4.16), EBAZ4205扩展_EPD_TX (J1.40)
EPD_D3: EBAZ4205扩展_连接 (JP4.15), EBAZ4205扩展_EPD_TX (J1.39)
EPD_D4: EBAZ4205扩展_连接 (JP4.18), EBAZ4205扩展_EPD_TX (J1.38)
EPD_D5: EBAZ4205扩展_连接 (JP4.17), EBAZ4205扩展_EPD_TX (J1.37)
EPD_D6: EBAZ4205扩展_连接 (JP4.20), EBAZ4205扩展_EPD_TX (J1.36)
EPD_D7: EBAZ4205扩展_连接 (JP4.19), EBAZ4205扩展_EPD_TX (J1.35)
EPD_D8: EBAZ4205扩展_连接 (JP5.5), EBAZ4205扩展_EPD_TX (J1.34)
EPD_D9: EBAZ4205扩展_连接 (JP5.6), EBAZ4205扩展_EPD_TX (J1.33)
EPD_D10: EBAZ4205扩展_连接 (JP5.7), EBAZ4205扩展_EPD_TX (J1.32)
EPD_D11: EBAZ4205扩展_连接 (JP5.8), EBAZ4205扩展_EPD_TX (J1.31)
EPD_D12: EBAZ4205扩展_连接 (JP5.10), EBAZ4205扩展_EPD_TX (J1.30)
EPD_D13: EBAZ4205扩展_连接 (JP5.12), EBAZ4205扩展_EPD_TX (J1.29)
EPD_D14: EBAZ4205扩展_连接 (JP5.13), EBAZ4205扩展_EPD_TX (J1.28)
EPD_D15: EBAZ4205扩展_连接 (JP5.14), EBAZ4205扩展_EPD_TX (J1.27)
EPD_PWR_EN: EBAZ4205扩展_连接 (JP4.6), EBAZ4205扩展_TPS65185 (R32.1 U2.12 U2.21)
EPD_S_DIR: EBAZ4205扩展_连接 (JP6.6), EBAZ4205扩展_EPD_TX (R34.1 R35.2 R36.2 R38.2)
EPD_SPV: EBAZ4205扩展_连接 (JP4.10), EBAZ4205扩展_EPD_TX (J1.46)
EPD_XCL: EBAZ4205扩展_连接 (JP4.12), EBAZ4205扩展_EPD_TX (J1.43)
EPD_XLE: EBAZ4205扩展_连接 (JP5.16), EBAZ4205扩展_EPD_TX (J1.25)
EPD_XSTL: EBAZ4205扩展_连接 (JP5.15), EBAZ4205扩展_EPD_TX (J1.26)
HDMI2RGB_DE: EBAZ4205扩展_连接 (JP6.14), EBAZ4205扩展_RGB_RX (JP7.20)
HDMI2RGB_HS: EBAZ4205扩展_连接 (JP6.13), EBAZ4205扩展_RGB_RX (JP7.22)
HDMI2RGB_P8: EBAZ4205扩展_连接 (JP6.18), EBAZ4205扩展_RGB_RX (JP7.23)
HDMI2RGB_P9: EBAZ4205扩展_连接 (JP6.12), EBAZ4205扩展_RGB_RX (JP7.24)
HDMI2RGB_P10: EBAZ4205扩展_连接 (JP6.17), EBAZ4205扩展_RGB_RX (JP7.25)
HDMI2RGB_P11: EBAZ4205扩展_连接 (JP6.10), EBAZ4205扩展_RGB_RX (JP7.26)
HDMI2RGB_P12: EBAZ4205扩展_连接 (JP6.20), EBAZ4205扩展_RGB_RX (JP7.27)
HDMI2RGB_P13: EBAZ4205扩展_连接 (JP6.8), EBAZ4205扩展_RGB_RX (JP7.28)
HDMI2RGB_P14: EBAZ4205扩展_连接 (JP6.19), EBAZ4205扩展_RGB_RX (JP7.29)
HDMI2RGB_P15: EBAZ4205扩展_连接 (JP6.5), EBAZ4205扩展_RGB_RX (JP7.30)
HDMI2RGB_PCLK: EBAZ4205扩展_连接 (JP6.16), EBAZ4205扩展_RGB_RX (JP7.15)
HDMI2RGB_VS: EBAZ4205扩展_连接 (JP6.15), EBAZ4205扩展_RGB_RX (JP7.21)
RESET: EBAZ4205扩展_连接 (JP6.7), EBAZ4205扩展_RGB_RX (JP7.17 R10.2)
SCL: EBAZ4205扩展_连接 (JP4.5 JP?.3 R8.1), EBAZ4205扩展_RGB_RX (JP7.19), EBAZ4205扩展_TPS65185 (U2.17)
SDA: EBAZ4205扩展_连接 (JP4.7 JP?.1 R9.1), EBAZ4205扩展_RGB_RX (JP7.18), EBAZ4205扩展_TPS65185 (U2.18)
SPI_MISO: EBAZ4205扩展_连接 (JP5.19 JP?.2), EBAZ4205扩展_EPD_TX (U3.13)
SPI_MOSI: EBAZ4205扩展_连接 (JP5.20 JP?.4), EBAZ4205扩展_EPD_TX (U3.12)
SPI_SCLK: EBAZ4205扩展_连接 (JP5.17 JP?.6), EBAZ4205扩展_EPD_TX (U3.11)
SPI_SS1: EBAZ4205扩展_连接 (JP5.18 JP?.8), EBAZ4205扩展_EPD_TX (U3.10)